# Altium project STM32F407ZGT6Floor.PrjPcb
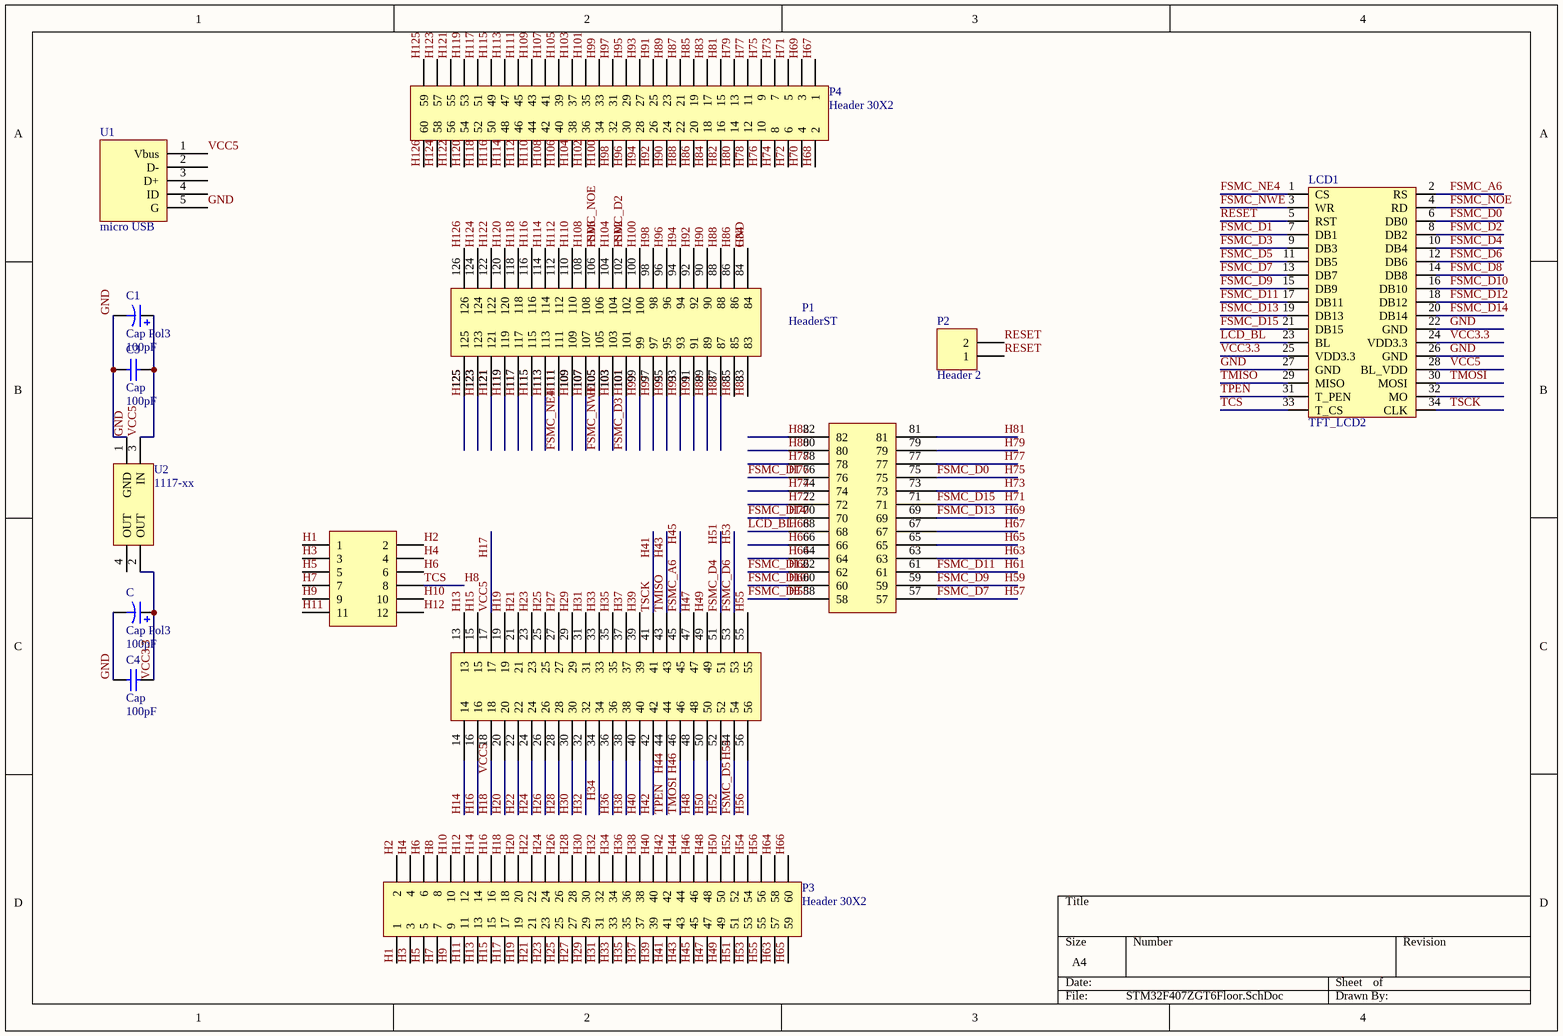
[diagram p0: STM32F407ZGT6Floor.SchDoc]
1 sheet, 11 parts. Net scope: global (net labels, ports and power ports of the same name join across sheets).
Board file: STM32F407ZGT6Floor.PcbDoc

## Sheet STM32F407ZGT6Floor.SchDoc
size A4

### Parts
C  Cap Pol3  value 100pF  [CAP_SMD_3216]
C1  Cap Pol3  value 100pF  [CAP_SMD_3216]
C3  Cap  value 100pF  [0805C]
C4  Cap  value 100pF  [0805C]
LCD1  TFT_LCD2  [DB2*17-3.5]
P1  HeaderST  [PCBComponent_1-1]
P2  Header 2  [HDR1X2]
P3  Header 30X2  [HDR2X30]
P4  Header 30X2  [HDR2X30]
U1  micro USB  [Micro_USB_v2 - duplicate]
U2  1117-xx  [SOT-223_]

### Nets
FSMC_A6: LCD1.2(RS) P1.45 P3.45  [also labelled H45]
FSMC_D0: LCD1.6(DB0) P1.75 P4.9  [also labelled H75]
FSMC_D1: LCD1.7(DB1) P1.76 P4.10  [also labelled H76]
FSMC_D2: LCD1.8(DB2) P1.102 P4.36  [also labelled H102]
FSMC_D3: LCD1.9(DB3) P1.101 P4.35  [also labelled H101]
FSMC_D4: LCD1.10(DB4) P1.51 P3.51  [also labelled H51]
FSMC_D5: LCD1.11(DB5) P1.54 P3.54  [also labelled H54]
FSMC_D6: LCD1.12(DB6) P1.53 P3.53  [also labelled H53]
FSMC_D7: LCD1.13(DB7) P1.57  [also labelled H57]
FSMC_D8: LCD1.14(DB8) P1.58  [also labelled H58]
FSMC_D9: LCD1.15(DB9) P1.59  [also labelled H59]
FSMC_D10: LCD1.16(DB10) P1.60  [also labelled H60]
FSMC_D11: LCD1.17(DB11) P1.61  [also labelled H61]
FSMC_D12: LCD1.18(DB12) P1.62  [also labelled H62]
FSMC_D13: LCD1.19(DB13) P1.69 P4.3  [also labelled H69]
FSMC_D14: LCD1.20(DB14) P1.70 P4.4  [also labelled H70]
FSMC_D15: LCD1.21(DB15) P1.71 P4.5  [also labelled H71]
FSMC_NE4: LCD1.1(CS) P1.111 P4.45  [also labelled H111]
FSMC_NOE: LCD1.4(RD) P1.106 P4.40  [also labelled H106]
FSMC_NWE: LCD1.3(WR) P1.105 P4.39  [also labelled H105]
GND: C.2 C1.2 C3.1 C4.1 LCD1.22(GND) LCD1.26(GND) LCD1.27(GND) P1.84 P4.18 U1.5(G) U2.1(GND)  [also labelled H84]
H1: P1.1 P3.1
H2: P1.2 P3.2
H3: P1.3 P3.3
H4: P1.4 P3.4
H5: P1.5 P3.5
H6: P1.6 P3.6
H7: P1.7 P3.7
H8: LCD1.33(T_CS) P1.8 P3.8  [also labelled TCS]
H9: P1.9 P3.9
H10: P1.10 P3.10
H11: P1.11 P3.11
H12: P1.12 P3.12
H13: P1.13 P3.13
H14: P1.14 P3.14
H15: P1.15 P3.15
H16: P1.16 P3.16
H17: C1.1 C3.2 LCD1.28(BL_VDD) P1.17 P1.18 P3.17 P3.18 U1.1(Vbus) U2.3(IN)  [also labelled H18, VCC5]
H19: P1.19 P3.19
H20: P1.20 P3.20
H21: P1.21 P3.21
H22: P1.22 P3.22
H23: P1.23 P3.23
H24: P1.24 P3.24
H25: P1.25 P3.25
H26: P1.26 P3.26
H27: P1.27 P3.27
H28: P1.28 P3.28
H29: P1.29 P3.29
H30: P1.30 P3.30
H31: P1.31 P3.31
H32: P1.32 P3.32
H33: P1.33 P3.33
H34: P1.34 P3.34
H35: P1.35 P3.35
H36: P1.36 P3.36
H37: P1.37 P3.37
H38: P1.38 P3.38
H39: P1.39 P3.39
H40: P1.40 P3.40
H41: LCD1.34(CLK) P1.41 P3.41  [also labelled TSCK]
H42: P1.42 P3.42
H43: LCD1.29(MISO) P1.43 P3.43  [also labelled TMISO]
H44: LCD1.31(T_PEN) P1.44 P3.44  [also labelled TPEN]
H46: LCD1.30(MOSI) P1.46 P3.46  [also labelled TMOSI]
H47: P1.47 P3.47
H48: P1.48 P3.48
H49: P1.49 P3.49
H50: P1.50 P3.50
H52: P1.52 P3.52
H55: P1.55 P3.55
H56: P1.56 P3.56
H63: P1.63 P3.57
H64: P1.64 P3.58
H65: P1.65 P3.59
H66: P1.66 P3.60
H67: P1.67 P4.1
H68: LCD1.23(BL) P1.68 P4.2  [also labelled LCD_BL]
H72: P1.72 P4.6
H73: P1.73 P4.7
H74: P1.74 P4.8
H77: P1.77 P4.11
H78: P1.78 P4.12
H79: P1.79 P4.13
H80: P1.80 P4.14
H81: P1.81 P4.15
H82: P1.82 P4.16
H83: P1.83 P4.17
H85: P1.85 P4.19
H86: P1.86 P4.20
H87: P1.87 P4.21
H88: P1.88 P4.22
H89: P1.89 P4.23
H90: P1.90 P4.24
H91: P1.91 P4.25
H92: P1.92 P4.26
H93: P1.93 P4.27
H94: P1.94 P4.28
H95: P1.95 P4.29
H96: P1.96 P4.30
H97: P1.97 P4.31
H98: P1.98 P4.32
H99: P1.99 P4.33
H100: P1.100 P4.34
H103: P1.103 P4.37
H104: P1.104 P4.38
H107: P1.107 P4.41
H108: P1.108 P4.42
H109: P1.109 P4.43
H110: P1.110 P4.44
H112: P1.112 P4.46
H113: P1.113 P4.47
H114: P1.114 P4.48
H115: P1.115 P4.49
H116: P1.116 P4.50
H117: P1.117 P4.51
H118: P1.118 P4.52
H119: P1.119 P4.53
H120: P1.120 P4.54
H121: P1.121 P4.55
H122: P1.122 P4.56
H123: P1.123 P4.57
H124: P1.124 P4.58
H125: P1.125 P4.59
H126: P1.126 P4.60
RESET: LCD1.5(RST) P2.1 P2.2
VCC3.3: C.1 C4.2 LCD1.24(VDD3.3) LCD1.25(VDD3.3) U2.2(OUT)

Not connected (* = marked no-connect by the designer): LCD1 32(MO); U1 2(D-) 3(D+) 4(ID); U2 4(OUT)

### Library data of the parts
C C1 = Cap Pol3: Polarized Capacitor (Surface Mount); Published: 8-Jun-2000; LatestRevisionDate: 29-May-2009; LatestRevisionNote: IPC-7351 Footprint Added.; PackageReference: C0805; Publisher: Altium Limited; PackageDescription: Chip Capacitor
C3 C4 = Cap: Capacitor; Published: 8-Jun-2000; LatestRevisionDate: 17-Jul-2002; LatestRevisionNote: Re-released for DXP Platform.; PackageReference: RAD-0.3; Publisher: Altium Limited; PackageDescription: Radial Cap, Thru-Hole; 2 Leads; 0.3 in Pin Spacing
P1 = HeaderST: Header, 30-Pin, Dual row; LatestRevisionDate: 17-Jul-2002; LatestRevisionNote: Re-released for DXP Platform.; Publisher: Altium Limited
P2 = Header 2: Header, 2-Pin; LatestRevisionDate: 17-Jul-2002; LatestRevisionNote: Re-released for DXP Platform.; Publisher: Altium Limited
P3 P4 = Header 30X2: Header, 30-Pin, Dual row; LatestRevisionDate: 17-Jul-2002; LatestRevisionNote: Re-released for DXP Platform.; Publisher: Altium Limited
U1 = usb-STM
U2 = 1117-xx: 稳压芯片